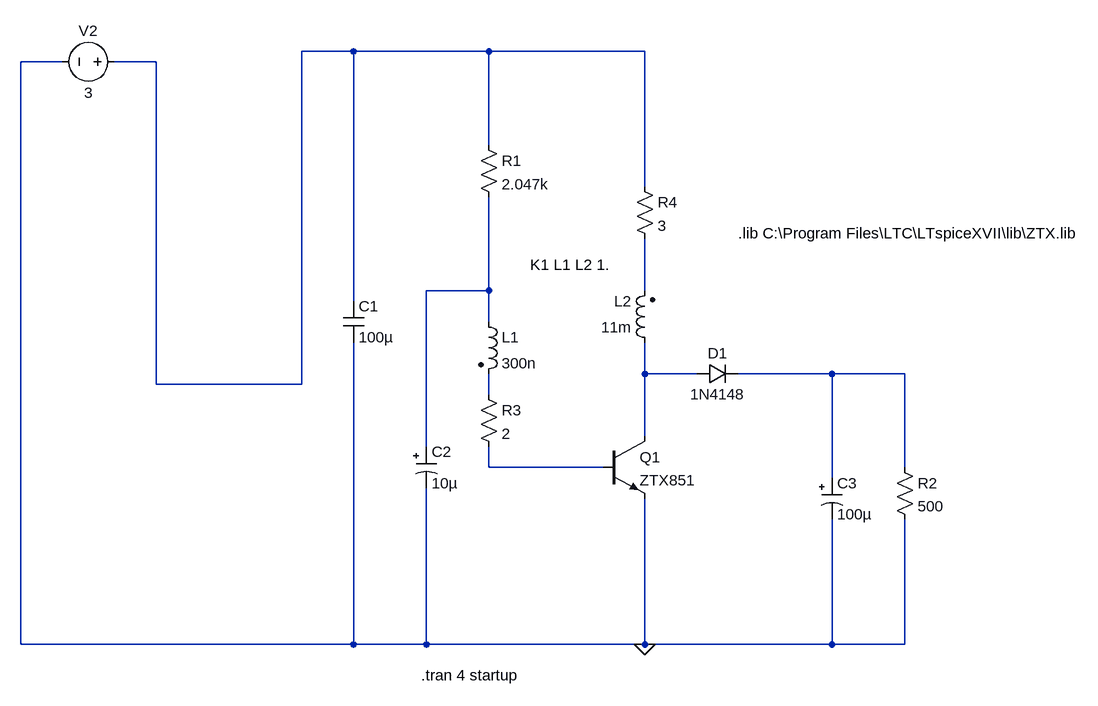
[diagram p0: schematic kursach.asc]
kursach.asc, the LTspice schematic file:
Version 4
SHEET 1 1552 680
WIRE 352 -2816 272 -2816
WIRE 560 -2816 352 -2816
WIRE 800 -2816 560 -2816
WIRE -96 -2800 -160 -2800
WIRE 48 -2800 -16 -2800
WIRE 560 -2672 560 -2816
WIRE 800 -2608 800 -2816
WIRE 560 -2448 560 -2592
WIRE 560 -2448 464 -2448
WIRE 800 -2448 800 -2528
WIRE 352 -2432 352 -2816
WIRE 560 -2400 560 -2448
WIRE 800 -2320 800 -2368
WIRE 880 -2320 800 -2320
WIRE 1088 -2320 944 -2320
WIRE 1200 -2320 1088 -2320
WIRE 48 -2304 48 -2800
WIRE 272 -2304 272 -2816
WIRE 272 -2304 48 -2304
WIRE 560 -2288 560 -2320
WIRE 800 -2224 800 -2320
WIRE 464 -2208 464 -2448
WIRE 560 -2176 560 -2208
WIRE 736 -2176 560 -2176
WIRE 1200 -2176 1200 -2320
WIRE 1088 -2160 1088 -2320
WIRE -160 -1904 -160 -2800
WIRE 352 -1904 352 -2368
WIRE 352 -1904 -160 -1904
WIRE 464 -1904 464 -2144
WIRE 464 -1904 352 -1904
WIRE 800 -1904 800 -2128
WIRE 800 -1904 464 -1904
WIRE 1088 -1904 1088 -2096
WIRE 1088 -1904 800 -1904
WIRE 1200 -1904 1200 -2096
WIRE 1200 -1904 1088 -1904
FLAG 800 -1904 0
SYMBOL npn 736 -2224 R0
SYMATTR InstName Q1
SYMATTR Value ZTX851
SYMBOL voltage 0 -2800 R90
WINDOW 0 -32 56 VBottom 2
WINDOW 3 32 56 VTop 2
WINDOW 123 0 0 Left 0
WINDOW 39 0 0 Left 0
SYMATTR InstName V2
SYMATTR Value 3
SYMBOL polcap 448 -2208 R0
WINDOW 3 24 56 Left 2
SYMATTR Value 10µ
SYMATTR InstName C2
SYMATTR Description Capacitor
SYMATTR Type cap
SYMATTR SpiceLine V=6.3 Irms=2.21565 Rser=0.055 Lser=0 mfg="KEMET" pn="A700V106M006ATE055" type="Al electrolytic"
SYMBOL res 544 -2688 R0
SYMATTR InstName R1
SYMATTR Value 2.047k
SYMBOL res 1184 -2192 R0
SYMATTR InstName R2
SYMATTR Value 500
SYMBOL ind2 544 -2416 R0
SYMATTR InstName L1
SYMATTR Value 300n
SYMATTR Type ind
SYMBOL ind2 816 -2352 R180
WINDOW 0 36 80 Left 2
WINDOW 3 36 40 Left 2
SYMATTR InstName L2
SYMATTR Value 11m
SYMATTR Type ind
SYMBOL polcap 1072 -2160 R0
WINDOW 3 24 56 Left 2
SYMATTR Value 100µ
SYMATTR InstName C3
SYMATTR Description Capacitor
SYMATTR Type cap
SYMATTR SpiceLine V=2 Irms=3 Rser=0.011 Lser=0 mfg="Rubycon" pn="2SXB100M" type="Al electrolytic"
SYMBOL diode 880 -2304 R270
WINDOW 0 32 32 VTop 2
WINDOW 3 0 32 VBottom 2
SYMATTR InstName D1
SYMATTR Value 1N4148
SYMBOL res 544 -2304 R0
SYMATTR InstName R3
SYMATTR Value 2
SYMBOL res 784 -2624 R0
SYMATTR InstName R4
SYMATTR Value 3
SYMBOL cap 336 -2432 R0
SYMATTR InstName C1
SYMATTR Value 100µ
TEXT 624 -2488 Left 2 !K1 L1 L2 1.
TEXT 456 -1856 Left 2 !.tran 4 startup
TEXT 944 -2536 Left 2 !.lib C:\\Program Files\\LTC\\LTspiceXVII\\lib\\ZTX.lib

The netlist it stands for:
* kursach.asc
Q1 N004 N007 0 0 ZTX851
V2 N001 0 3
C2 N002 0 10µ V=6.3 Irms=2.21565 Rser=0.055 Lser=0 mfg="KEMET" pn="A700V106M006ATE055" type="Al electrolytic"
R1 N001 N002 2.047k
R2 N005 0 500
L1 N002 N006 300n
L2 N004 N003 11m
C3 N005 0 100µ V=2 Irms=3 Rser=0.011 Lser=0 mfg="Rubycon" pn="2SXB100M" type="Al electrolytic"
D1 N004 N005 1N4148
R3 N006 N007 2
R4 N001 N003 3
C1 N001 0 100µ
.model D D
.lib standard.dio
.model NPN NPN
.model PNP PNP
.lib standard.bjt
K1 L1 L2 1.
.tran 4 startup
.lib C:\Program Files\LTC\LTspiceXVII\lib\ZTX.lib
.backanno
.end